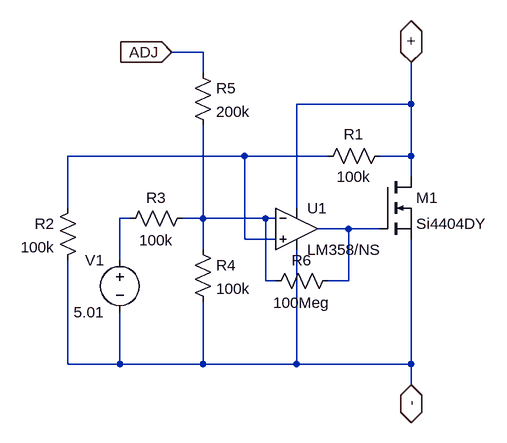
[diagram p0: schematic LM336-5.0.asc]
LM336-5.0.asc, the LTspice schematic file:
Version 4
SHEET 1 940 680
WIRE 400 -32 352 -32
WIRE 400 0 400 -32
WIRE 720 48 720 -16
WIRE 720 48 544 48
WIRE 464 128 192 128
WIRE 592 128 464 128
WIRE 720 128 720 48
WIRE 720 128 672 128
WIRE 720 160 720 128
WIRE 192 208 192 128
WIRE 544 208 544 48
WIRE 288 224 272 224
WIRE 400 224 400 80
WIRE 400 224 368 224
WIRE 496 224 400 224
WIRE 512 224 496 224
WIRE 624 240 576 240
WIRE 672 240 624 240
WIRE 464 256 464 128
WIRE 512 256 464 256
WIRE 400 272 400 224
WIRE 272 288 272 224
WIRE 496 320 496 224
WIRE 512 320 496 320
WIRE 624 320 624 240
WIRE 624 320 592 320
WIRE 192 448 192 288
WIRE 272 448 272 368
WIRE 272 448 192 448
WIRE 400 448 400 352
WIRE 400 448 272 448
WIRE 544 448 544 272
WIRE 544 448 400 448
WIRE 720 448 720 256
WIRE 720 448 544 448
WIRE 720 480 720 448
FLAG 720 -16 +
IOPIN 720 -16 BiDir
FLAG 352 -32 ADJ
IOPIN 352 -32 In
FLAG 720 480 -
IOPIN 720 480 BiDir
SYMBOL voltage 272 272 M0
SYMATTR InstName V1
SYMATTR Value 5.01
SYMBOL nmos 672 160 R0
SYMATTR InstName M1
SYMATTR Value Si4404DY
SYMBOL res 688 112 R90
WINDOW 0 -2 56 VBottom 2
WINDOW 3 32 56 VTop 2
SYMATTR InstName R1
SYMATTR Value 100k
SYMBOL res 208 192 M0
SYMATTR InstName R2
SYMATTR Value 100k
SYMBOL EXTRA\\ExtraOpamps\\LM358_NS 544 240 R0
SYMATTR InstName U1
SYMBOL res 272 240 R270
WINDOW 0 32 56 VTop 2
WINDOW 3 -2 56 VBottom 2
SYMATTR InstName R3
SYMATTR Value 100k
SYMBOL res 384 256 R0
SYMATTR InstName R4
SYMATTR Value 100k
SYMBOL res 384 -16 R0
SYMATTR InstName R5
SYMATTR Value 200k
SYMBOL res 496 336 R270
WINDOW 0 32 56 VTop 2
WINDOW 3 -2 56 VBottom 2
SYMATTR InstName R6
SYMATTR Value 100Meg

The netlist it stands for:
* LM336-5.0.asc
V1 N002 - 5.01
M1 + N004 - - Si4404DY
R1 + N001 100k
R2 N001 - 100k
XU1 N001 N003 + - N004 LM358/NS  ; pins In+ In- V+ V- OUT
R3 N002 N003 100k
R4 N003 - 100k
R5 ADJ N003 200k
R6 N003 N004 100Meg
.model NMOS NMOS
.model PMOS PMOS
.lib standard.mos
.backanno
.end